# EAGLE design cw304_notduino_02 (EAGLE 7.5.0)
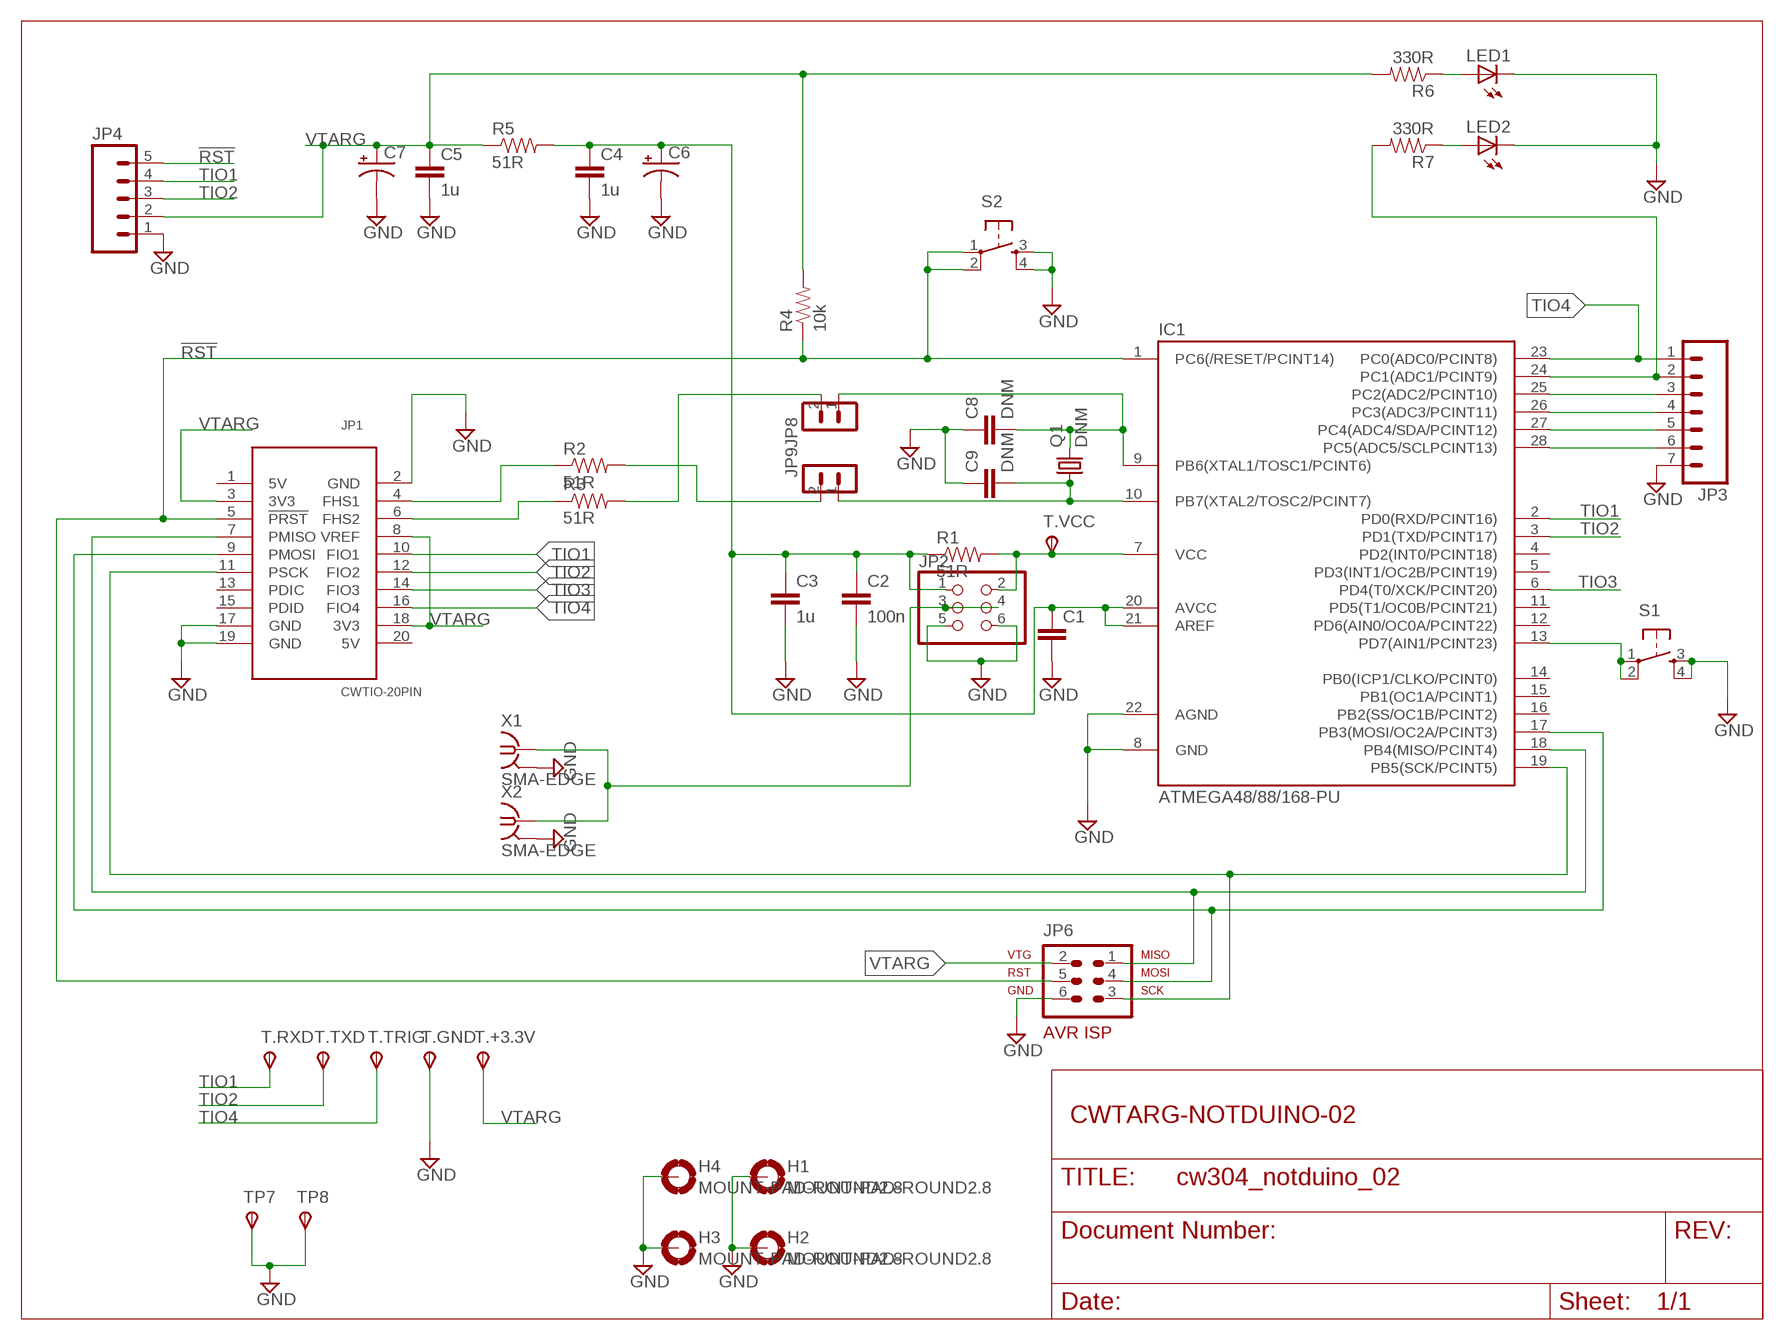
[diagram p0: schematic, sheet 1]

## Parts
C1  CAPPTH  [CAP-PTH-SMALL]
C2  100n  CAPPTH  [CAP-PTH-SMALL]
C3  1u  CAPPTH  [CAP-PTH-SMALL]
C4  1u  CAPPTH  [CAP-PTH-SMALL]
C5  1u  CAPPTH  [CAP-PTH-SMALL]
C6  CAP_POLPTH1  [CPOL-RADIAL-100UF-25V]
C7  CAP_POLPTH1  [CPOL-RADIAL-100UF-25V]
C8  DNM  CAPPTH  [CAP-PTH-SMALL]
C9  DNM  CAPPTH  [CAP-PTH-SMALL]
H1  MOUNT-PAD-ROUND2.8  [2,8-PAD]
H2  MOUNT-PAD-ROUND2.8  [2,8-PAD]
H3  MOUNT-PAD-ROUND2.8  [2,8-PAD]
H4  MOUNT-PAD-ROUND2.8  [2,8-PAD]
IC1  ATMEGA48/88/168-PU  [DIL28-3]
JP1  CWTIO-20PIN  [PINSHRD_PTH_2X10]
JP2  PINHD-2X3  [2X03]
JP3  M07LOCK  [1X07_LOCK]
JP4  M05LOCK  [1X05_LOCK]
JP6  AVR-ISP-6  [AVR-ISP-6]
JP8  M02LOCK  [1X02_LOCK]
JP9  M02LOCK  [1X02_LOCK]
LED1  LED5MM  [LED5MM]
LED2  LED5MM  [LED5MM]
Q1  DNM  CRYSTALHC49U-V  [HC49U-V]
R1  51R  RESISTORPTH-1/4W  [AXIAL-0.4]
R2  51R  RESISTORPTH-1/4W  [AXIAL-0.4]
R3  51R  RESISTORPTH-1/4W  [AXIAL-0.4]
R4  10k  RESISTORPTH-1/4W  [AXIAL-0.4]
R5  51R  RESISTORPTH-1/4W  [AXIAL-0.4]
R6  330R  RESISTORPTH-1/4W  [AXIAL-0.4]
R7  330R  RESISTORPTH-1/4W  [AXIAL-0.4]
S1  TAC_SWITCHPTH  [TACTILE-PTH]
S2  TAC_SWITCHPTH  [TACTILE-PTH]
T.+3.3V  TPSPAD1-13  [P1-13]
T.GND  TPSPAD1-13  [P1-13]
T.RXD  TPSPAD1-13  [P1-13]
T.TRIG  TPSPAD1-13  [P1-13]
T.TXD  TPSPAD1-13  [P1-13]
T.VCC  TPSPAD1-17  [P1-17]
TP7  TPSPAD1-17  [P1-17]
TP8  TPSPAD1-17  [P1-17]
X1  SMA-EDGE  [J502-ND-142-0711-821/826]
X2  SMA-EDGE  [J502-ND-142-0711-821/826]

## Nets
!RST: IC1.1(PC6(/RESET/PCINT14)) JP1.5(!PRST) JP4.5 JP6.5 R4.P$1 S2.1 S2.2
GND: C1.2 C2.2 C3.2 C4.2 C5.2 C6.2(-) C7.2(-) C8.1 C9.1 H1.B2,8(MOUNT) H2.B2,8(MOUNT) H3.B2,8(MOUNT) H4.B2,8(MOUNT) IC1.8(GND) IC1.22(AGND) JP1.2(GND) JP1.17(GND) JP1.19(GND) JP2.5 JP2.6 JP3.7 JP4.1 JP6.6 LED1.K(C) LED2.K(C) S1.3 S1.4 S2.3 S2.4 T.GND.TP(PP) TP7.TP(PP) TP8.TP(PP) X1.G@1 X1.G@2 X1.G@3 X1.G@4 X2.G@1 X2.G@2 X2.G@3 X2.G@4
N$2: LED2.A R7.P$1
N$4: IC1.18(PB4(MISO/PCINT4)) JP1.7(PMISO) JP6.1
N$5: IC1.17(PB3(MOSI/OC2A/PCINT3)) JP1.9(PMOSI) JP6.4
N$6: JP1.4(FHS1) R2.P$1
N$7: JP1.6(FHS2) R3.P$1
N$8: IC1.19(PB5(SCK/PCINT5)) JP1.11(PSCK) JP6.3
N$9: IC1.7(VCC) JP2.2 R1.P$2 T.VCC.TP(PP)
N$10: LED1.A R6.P$1
N$11: C1.1 C2.1 C3.1 C4.1 C6.1(+) IC1.20(AVCC) IC1.21(AREF) JP2.1 R1.P$1 R5.P$2
N$12: C8.2 IC1.9(PB6(XTAL1/TOSC1/PCINT6)) JP8.1 Q1.2
N$16: IC1.13(PD7(AIN1/PCINT23)) S1.1 S1.2
N$18: IC1.24(PC1(ADC1/PCINT9)) JP3.2 R7.P$2
N$19: IC1.25(PC2(ADC2/PCINT10)) JP3.3
N$20: IC1.26(PC3(ADC3/PCINT11)) JP3.4
N$21: IC1.27(PC4(ADC4/SDA/PCINT12)) JP3.5
N$22: IC1.28(PC5(ADC5/SCLPCINT13)) JP3.6
N$23: JP2.3 JP2.4 X1.1 X2.1
N$24: C9.2 IC1.10(PB7(XTAL2/TOSC2/PCINT7)) JP9.1 Q1.1
THS1: JP9.2 R2.P$2
THS2: JP8.2 R3.P$2
TIO1: IC1.2(PD0(RXD/PCINT16)) JP1.10(FIO1) JP4.4 T.RXD.TP(PP)
TIO2: IC1.3(PD1(TXD/PCINT17)) JP1.12(FIO2) JP4.3 T.TXD.TP(PP)
TIO3: IC1.6(PD4(T0/XCK/PCINT20)) JP1.14(FIO3)
TIO4: IC1.23(PC0(ADC0/PCINT8)) JP1.16(FIO4) JP3.1 T.TRIG.TP(PP)
VTARG: C5.1 C7.1(+) JP1.3(3V3) JP1.8(VREF) JP1.18(3V3) JP4.2 JP6.2 R4.P$2 R5.P$1 R6.P$2 T.+3.3V.TP(PP)
Unconnected: IC1.4(PD2(INT0/PCINT18)) IC1.5(PD3(INT1/OC2B/PCINT19)) IC1.11(PD5(T1/OC0B/PCINT21)) IC1.12(PD6(AIN0/OC0A/PCINT22)) IC1.14(PB0(ICP1/CLKO/PCINT0)) IC1.15(PB1(OC1A/PCINT1)) IC1.16(PB2(SS/OC1B/PCINT2)) JP1.1(5V) JP1.13(PDIC) JP1.15(PDID) JP1.20(5V)

## Notes on the sheet
- CWTARG-NOTDUINO-02

## Library data of the parts
C1-C5 C8 C9 = SparkFun:CAP: Capacitor Standard 0603 ceramic capacitor, and 0.1" leaded capacitor.
C6 C7 = SparkFun:CAP_POL: Capacitor Polarized These are standard SMD and PTH capacitors. Normally 10uF, 47uF, and 100uF in electrolytic and tantalum varieties. Always verify the external diameter of the through hole cap, it varies with capacity, voltage, and manufacturer. The EIA devices should be standard.
H1-H4 = holes:MOUNT-PAD-ROUND: MOUNTING PAD, round
IC1 = atmega8:ATMEGA48/88/168-PU
JP1 = chipwhisperer:CWTIO-20PIN
JP2 = pinhead:PINHD-2X3: PIN HEADER
JP3 = SparkFun:M07: Header 7 Standard 7-pin 0.1" header. Use with straight break away headers (SKU : PRT-00116), right angle break away headers (PRT-00553), swiss pins (PRT-00743), machine pins (PRT-00117), and female headers (PRT-00115). NOTES ON THE VARIANTS LOCK and LOCK_LONGPADS... This footprint was designed to help hold the alignment of a through-hole component (i.e. 7-pin header) while soldering it into place. You may notice that each hole has been shifted either up or down by 0.005 of an inch from it's more standard position (which is usually a perfectly straight line). This slight alteration caused the pins (the squares in the middle) to touch the edges of the holes. Because they are alternating, it causes a "brace" to hold the header in place. 0.005 has proven to be the perfect amount of "off-center" position when using our standard breakaway headers. Although looks a little odd when you look at the bare footprint, once you have a header in there, the alteration is very hard to notice. Also, if you push a header all the way into place, it is covered up entirely on the bottom side. This idea of altering the position of holes to aid alignment will be further integrated into the Sparkfun Library for other footprints. It can help hold any component with 3 or more connection pins.
JP4 = SparkFun:M05: Header 5 Standard 5-pin 0.1" header. Use with straight break away headers (SKU : PRT-00116), right angle break away headers (PRT-00553), swiss pins (PRT-00743), machine pins (PRT-00117), and female headers (PRT-00115). Molex polarized connector foot print use with SKU : PRT-08230 with associated crimp pins and housings.
JP6 = avr-6:AVR-ISP-6: AVR ISP-6 Serial Programming Header
JP8 JP9 = SparkFun:M02: Header 2 Standard 2-pin 0.1" header. Use with straight break away headers (SKU : PRT-00116), right angle break away headers (PRT-00553), swiss pins (PRT-00743), machine pins (PRT-00117), and female headers (PRT-00115). Molex polarized connector foot print use with SKU : PRT-08233 with associated crimp pins and housings.
LED1 LED2 = led:LED: LED OSRAM: - CHIPLED LG R971, LG N971, LY N971, LG Q971, LY Q971, LO R971, LY R971 LH N974, LH R974 LS Q976, LO Q976, LY Q976 LO Q996 - Hyper CHIPLED LW Q18S LB Q993, LB Q99A, LB R99A - SideLED LS A670, LO A670, LY A670, LG A670, LP A670 LB A673, LV A673, LT A673, LW A673 LH A674 LY A675 LS A676, LA A676, LO A676, LY A676, LW A676 LS A679, LY A679, LG A679 - Hyper Micro SIDELED® LS Y876, LA Y876, LO Y876, LY Y876 LT Y87S - SmartLED LW L88C, LW L88S LB L89C, LB L89S, LG L890 LS L89K, LO L89K, LY L89K LS L896, LA L896, LO L896, LY L896 - TOPLED LS T670, LO T670, LY T670, LG T670, LP T670 LSG T670, LSP T670, LSY T670, LOP T670, LYG T670 LG T671, LOG T671, LSG T671 LB T673, LV T673, LT T673, LW T673 LH T674 LS T676, LA T676, LO T676, LY T676, LB T676, LH T676, LSB T676, LW T676 LB T67C, LV T67C, LT T67C, LS T67K, LO T67K, LY T67K, LW E67C LS E67B, LA E67B, LO E67B, LY E67B, LB E67C, LV E67C, LT E67C LW T67C LS T679, LY T679, LG T679 LS T770, LO T770, LY T770, LG T770, LP T770 LB T773, LV T773, LT T773, LW T773 LH T774 LS E675, LA E675, LY E675, LS T675 LS T776, LA T776, LO T776, LY T776, LB T776 LHGB T686 LT T68C, LB T68C - Hyper Mini TOPLED® LB M676 - Mini TOPLED Santana® LG M470 LS M47K, LO M47K, LY M47K Source: http://www.osram.convergy.de LUXEON: - LUMILED® LXK2-PW12-R00, LXK2-PW12-S00, LXK2-PW14-U00, LXK2-PW14-V00 LXK2-PM12-R00, LXK2-PM12-S00, LXK2-PM14-U00 LXK2-PE12-Q00, LXK2-PE12-R00, LXK2-PE12-S00, LXK2-PE14-T00, LXK2-PE14-U00 LXK2-PB12-K00, LXK2-PB12-L00, LXK2-PB12-M00, LXK2-PB14-N00, LXK2-PB14-P00, LXK2-PB14-Q00 LXK2-PR12-L00, LXK2-PR12-M00, LXK2-PR14-Q00, LXK2-PR14-R00 LXK2-PD12-Q00, LXK2-PD12-R00, LXK2-PD12-S00 LXK2-PH12-R00, LXK2-PH12-S00 LXK2-PL12-P00, LXK2-PL12-Q00, LXK2-PL12-R00 Source: www.luxeon.com KINGBRIGHT: KA-3528ASYC Source: www.kingbright.com
Q1 = crystal:CRYSTAL: CRYSTAL; OC_FARNELL: 1666969; OC_NEWARK: unknown
R1-R7 = SparkFun:RESISTOR: Resistor Basic schematic elements and footprints for 0603, 1206, and PTH resistors.
S1 S2 = SparkFun:TAC_SWITCH: Momentary Switch Button commonly used for reset or general input. Spark Fun Electronics SKU : COM-00097
T.+3.3V T.GND T.RXD T.TRIG T.TXD T.VCC TP7 TP8 = testpad:TPS: TEST PIN
X1 X2 = custom-std:SMA-: SMA 50 Ohm End Launch Jack Receptacle - Round Contact Johnson Components Source: www.johnsoncomponents.com .. J502-ND.pdf; MF: JOHNSON COMPONENTS; MPN: 142-0711-821; OC_FARNELL: 1019328; OC_NEWARK: 16F3627

## Board
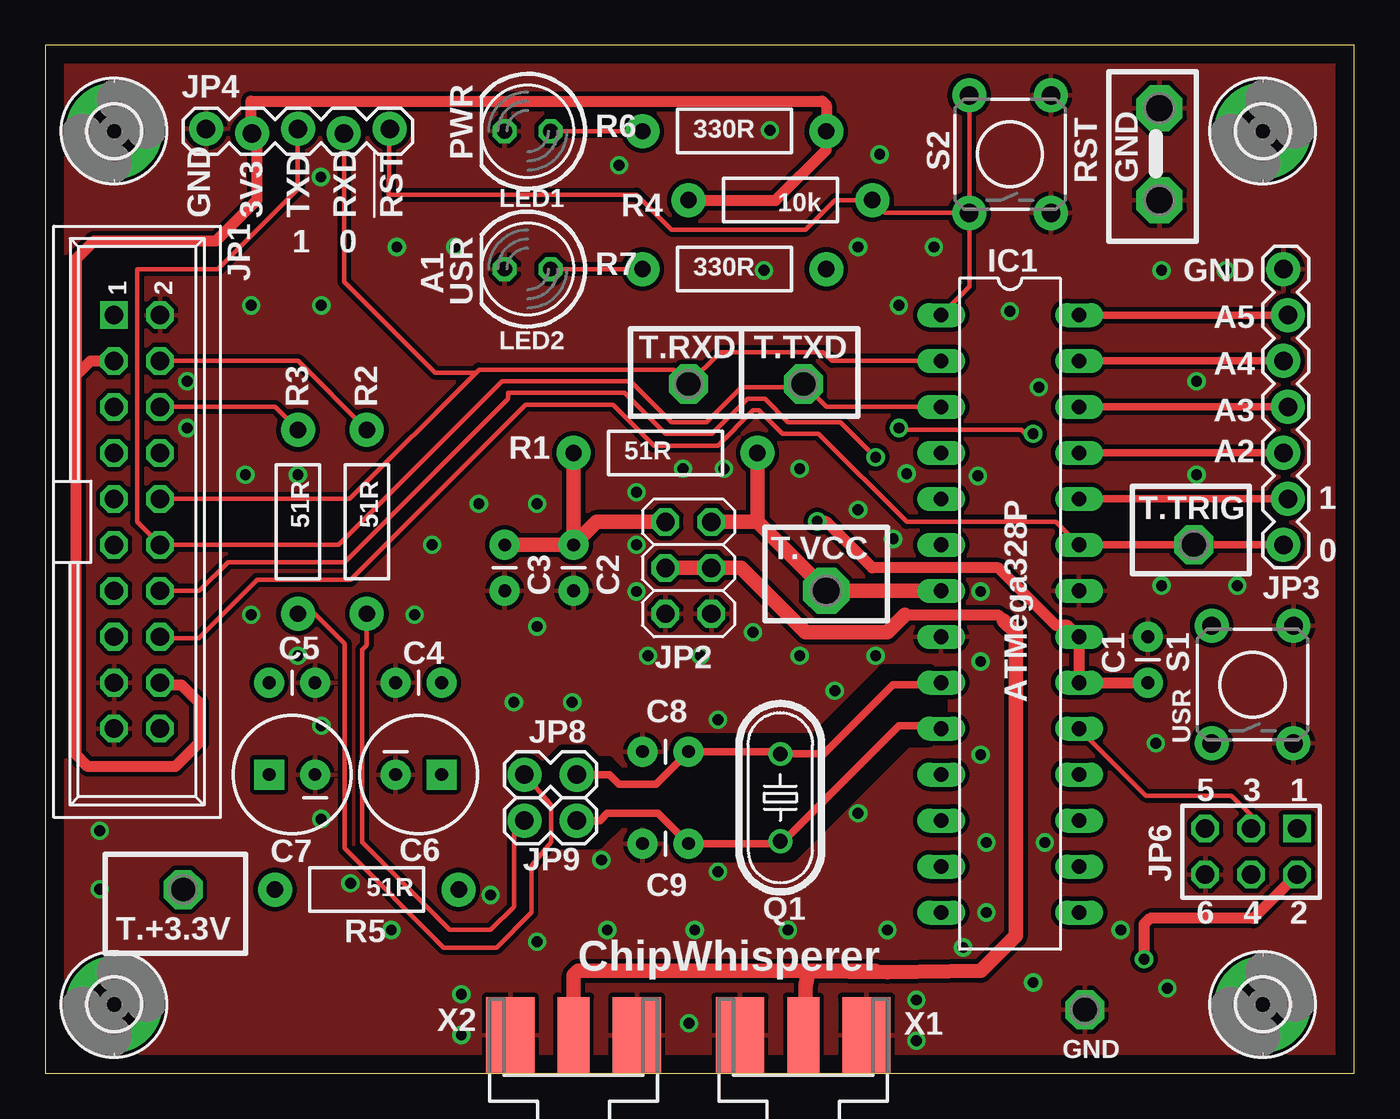
[diagram p1: board, top side]
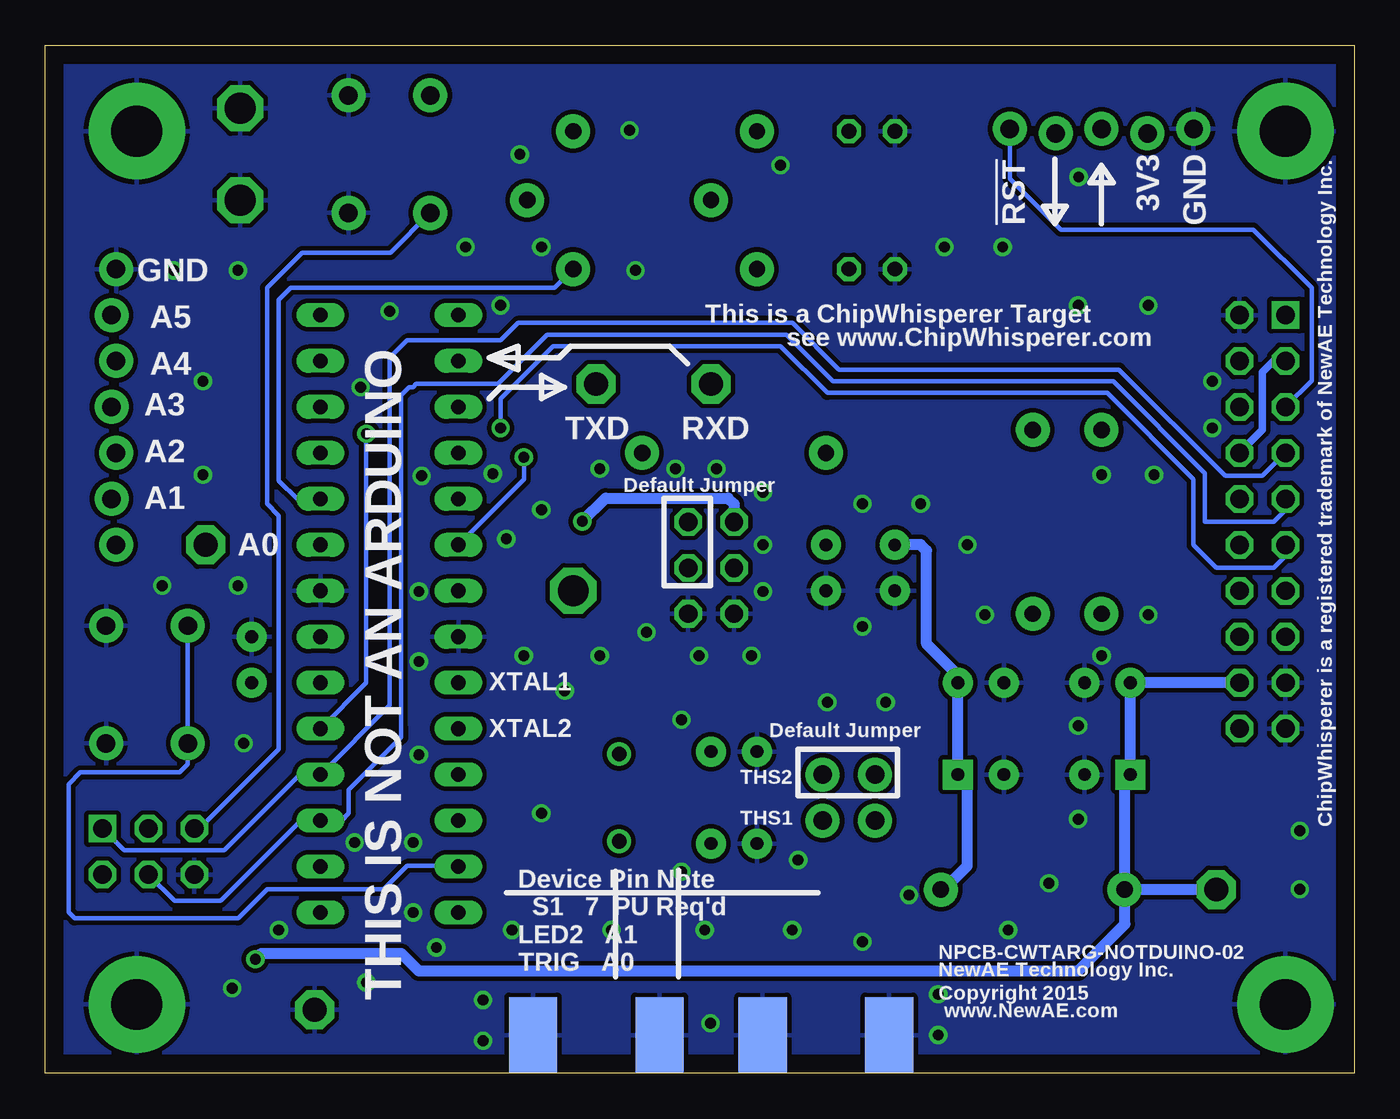
[diagram p2: board, bottom side, seen from below]

Size 72.37 x 56.82 mm. Coordinates in mm from the lower left corner, seen from the top.
Outline: 0,0 72.37,0 72.37,56.82 0,56.82 0,0
Copper layers (1*16): Top 0.035mm / dielectric 1.5mm / Bottom 0.035mm
Design rules "default *": minimum track width 10mil, minimum drill 24mil, track to track 8mil, track to pad 8mil, pad to pad 8mil, via to via 8mil, smd to smd 8mil, copper to edge 40mil, drill to drill 8mil, minimum pad ring 10mil, minimum via ring 8mil, stop-mask expansion 4mil, vias tented up to drill 40mil, thermal gap 10mil
tRestrict: 23 lines

### Footprints (pad centres in the part's own frame; a part is rotated, then mirrored left to right if it is on the bottom)
CAP-PTH-SMALL = drill 0.7 pad 1.651: 1 0,0; 2 2.54,0
CPOL-RADIAL-100UF-25V = drill 0.7 pad 1.651 square: 1 1.27,0 | drill 0.7 pad 1.651: 2 -1.27,0
2,8-PAD = drill 2.8 pad 5.334: B2,8 0,0
DIL28-3 = drill 0.813 long: 1 -16.51,-3.81; 2 -13.97,-3.81; 3 -11.43,-3.81; 4 -8.89,-3.81; 5 -6.35,-3.81; 6 -3.81,-3.81; 7 -1.27,-3.81; 8 1.27,-3.81; 9 3.81,-3.81; 10 6.35,-3.81; 11 8.89,-3.81; 12 11.43,-3.81; 13 13.97,-3.81; 14 16.51,-3.81; 15 16.51,3.81; 16 13.97,3.81; 17 11.43,3.81; 18 8.89,3.81; 19 6.35,3.81; 20 3.81,3.81; 21 1.27,3.81; 22 -1.27,3.81; 23 -3.81,3.81; 24 -6.35,3.81; 25 -8.89,3.81; 26 -11.43,3.81; 27 -13.97,3.81; 28 -16.51,3.81
PINSHRD_PTH_2X10 = drill 1.016 square: 1 -11.43,-1.27 | drill 1.016 octagon: 2 -11.43,1.27; 3 -8.89,-1.27; 4 -8.89,1.27; 5 -6.35,-1.27; 6 -6.35,1.27; 7 -3.81,-1.27; 8 -3.81,1.27; 9 -1.27,-1.27; 10 -1.27,1.27; 11 1.27,-1.27; 12 1.27,1.27; 13 3.81,-1.27; 14 3.81,1.27; 15 6.35,-1.27; 16 6.35,1.27; 17 8.89,-1.27; 18 8.89,1.27; 19 11.43,-1.27; 20 11.43,1.27
2X03 = drill 1.016 octagon: 1 -2.54,-1.27; 2 -2.54,1.27; 3 0,-1.27; 4 0,1.27; 5 2.54,-1.27; 6 2.54,1.27
1X07_LOCK = drill 1.016 pad 1.88: 1 0,0.127; 2 2.54,-0.127; 3 5.08,0.127; 4 7.62,-0.127; 5 10.16,0.127; 6 12.7,-0.127; 7 15.24,0.127
1X05_LOCK = drill 1.016 pad 1.88: 1 0,0.127; 2 2.54,-0.127; 3 5.08,0.127; 4 7.62,-0.127; 5 10.16,0.127
AVR-ISP-6 = drill 1.016 square: 1 -2.54,-1.27 | drill 1.016 octagon: 2 -2.54,1.27; 3 0,-1.27; 4 0,1.27; 5 2.54,-1.27; 6 2.54,1.27
1X02_LOCK = drill 1.016 pad 1.88: 1 -0.178,0; 2 2.718,0
LED5MM = drill 0.813 octagon: A -1.27,0; K 1.27,0
HC49U-V = drill 0.813: 1 -2.413,0; 2 2.413,0
AXIAL-0.4 = drill 0.9 pad 1.88: P$1 -5.08,0; P$2 5.08,0
TACTILE-PTH = drill 1.016 pad 1.88: 1 -3.251,2.261; 2 3.251,2.261; 3 -3.251,-2.261; 4 3.251,-2.261
P1-13 = drill 1.321 pad 2.159 octagon: TP 0,0
P1-17 = drill 1.702 pad 2.54 octagon: TP 0,0
J502-ND-142-0711-821/826 = smd 4.191 x 1.778: 1 2.115,0 | smd 4.191 x 2.667: G@1 2.115,3.495; G@2 2.115,-3.495 | smd 4.191 x 2.667 bottom: G@3 2.115,3.495; G@4 2.115,-3.495

### Placement (x,y rotation side)
C1  60.96,21.59 90 top
C2  29.21,29.21 270 top
C3  25.4,29.21 270 top
C4  21.91,21.59 180 top
C5  12.38,21.59 0 top
C6  20.64,16.51 0 top
C7  13.65,16.51 180 top
C8  33.02,17.78 0 top
C9  33.02,12.7 0 top
H1  3.81,3.81 0 top
H2  3.81,52.07 0 top
H3  67.31,52.07 0 top
H4  67.31,3.81 0 top
IC1  53.34,25.4 270 top
JP1  5.08,30.48 270 top
JP2  35.56,27.94 270 top
JP3  68.58,29.21 90 top
JP4  8.89,52.07 0 top
JP6  66.66,12.26 180 top
JP8  29.21,16.51 180 top
JP9  29.21,13.97 180 top
LED1  26.67,52.07 180 top
LED2  26.67,44.45 180 top
Q1  40.64,15.24 90 top
R1  34.29,34.29 0 top
R2  17.78,30.48 270 top
R3  13.97,30.48 270 top
R4  40.64,48.26 180 top
R5  17.78,10.16 0 top
R6  38.1,52.07 0 top
R7  38.1,44.45 0 top
S1  66.75,21.49 90 top
S2  53.34,50.8 90 top
T.+3.3V  7.62,10.16 0 top
T.GND  57.47,3.51 0 top
T.RXD  35.56,38.1 0 top
T.TRIG  63.5,29.21 0 top
T.TXD  41.91,38.1 0 top
T.VCC  43.18,26.67 0 top
TP7  61.59,53.34 0 top
TP8  61.59,48.26 0 top
X1  41.91,0 90 top
X2  29.21,0 90 top

### Tracks (layer width: path | path; a pad name or v marks a point on that pad's centre or on a via)
!RST
  Top 0.254: IC1.1 51.08,43.46 S2.1 | S2.1 S2.2 | R4.P$1 46.43,47.55 S2.1 | JP4.5 18.99,48.57 32.68,48.57 34.62,46.63 42.04,46.63 43.66,48.26 R4.P$1 | 45.72,48.76 R4.P$1
  Bottom 0.254: S2.1 53.28,45.34 58.17,45.34 60.1,43.41 60.1,31.47 59.46,30.83 59.46,17.93 63.85,13.53 JP6.5 | JP1.5 2.36,38.28 2.36,43.41 5.59,46.63 16.23,46.63 19.05,49.45 JP4.5
GND  (via drill 0.6)
  other vias: 45.91,23.09 41.71,23.09 43.65,21.15 37.2,19.54 37.2,11.15 44.94,14.38 30.75,11.8 27.2,7.28 24.62,9.86 19.13,7.92 16.88,10.51 15.26,14.05 15.26,19.22 13.97,23.09 11.39,25.34 20.42,25.34 13.97,33.09 11.07,33.09 7.84,35.67 7.84,38.25 27.2,31.47 23.97,31.47 27.2,24.7 21.39,29.22 32.68,29.22 32.68,26.63 32.68,32.12 35.26,33.41 37.52,33.41 41.71,33.41 44.94,31.15 46.88,29.54 51.71,26.63 51.71,22.76 51.71,17.6 52.04,12.76 52.04,8.89 55.26,12.76 54.62,5.02 48.17,1.8 46.55,7.92 41.07,7.92 35.91,7.92 31.07,7.92 35.59,2.76 48.17,4.05 23,2.12 3,10.18 3,13.41 15.24,49.54 11.39,42.44 15.26,42.44 19.44,45.67 22.66,45.67 44.94,45.67 49.13,45.67 39.74,44.38 46.13,50.79 40.06,52.12 31.71,50.18 33.33,23.09 36.23,23.09 39.13,24.38 29.13,20.51 25.91,20.51 61.71,26.96 65.91,26.96 61.71,44.38 65.26,44.38 53.33,42.12 47.2,42.44 54.94,37.92 51.56,33.02 47.62,33.15 63.65,33.09 63.65,38.25 50.75,6.96 23,4.38 61.39,18.25 59.46,7.92 62.04,4.7
  pour Top (isolate 0.254): 0.1,56.96 72.36,56.96 72.36,-0.14 0.1,-0.14
  pour Bottom (isolate 0.254): 0.1,56.96 72.36,56.96 72.36,-0.46 -0.22,-0.46 -0.22,56.96
N$2
  Top 0.254: R7.P$1 LED2.A
N$4
  Bottom 0.254: JP1.7 5.08,33.02 7.13,33.02 13.01,38.89 28.49,38.89 31.07,41.47 46.23,41.47 47.2,40.51 52.36,40.51 53.33,39.54 53.33,20.33 IC1.18 58.29,16.51 62.48,12.32 68,12.32 JP6.1
N$5
  Bottom 0.254: 3.81,32.28 JP1.9 3.81,31.12 4.45,30.48 8.26,30.48 8.26,33.17 13.33,38.25 28.81,38.25 31.39,40.83 44.62,40.83 47.35,38.1 51.86,38.1 52.04,37.92 52.24,37.92 52.7,37.47 52.7,19.11 52.68,19.08 52.68,18.57 55.59,15.67 55.59,14.38 55.99,13.97 IC1.17 58.25,13.97 62.68,9.54 65.21,9.54 JP6.4
N$6
  Top 0.254: JP1.4 13.97,39.37 R2.P$1
N$7
  Top 0.254: JP1.6 12.7,36.83 R3.P$1
N$8  (via drill 0.6)
  Top 0.254: v47.2,35.67 47.3,35.56 53.98,35.56 54.19,35.34 v54.62,35.34 | IC1.19 60.86,15.34 65.59,15.34 66.67,14.27 JP6.3
  Bottom 0.254: v47.2,35.67 47.2,37.28 44.3,40.18 31.71,40.18 29.13,37.6 13.65,37.6 8.89,32.84 8.89,29.21 7.62,27.94 4.45,27.94 3.81,28.58 JP1.11 | IC1.19 54.62,21.58 v54.62,35.34
N$9
  Top 0.813: IC1.7 T.VCC.TP | T.VCC.TP 42.97,26.67 42.68,26.96 42.89,26.96 T.VCC.TP | JP2.2 39.37,30.48 | 39.37,30.48 T.VCC.TP | R1.P$2 39.37,30.48
N$10
  Top 0.254: R6.P$1 LED1.A
N$11  (via drill 0.6)
  Top 0.61: C1.1 IC1.20 IC1.21 56.52,24.77 55.88,24.77 52.7,27.94 45.72,27.94 43.16,30.51 v42.68,30.51
  Top 0.813: R1.P$1 C2.1 | JP2.1 30.48,30.48 C2.1 | C3.1 C2.1
  Bottom 0.61: R5.P$2 22.7,10.16 21.39,11.47 21.39,15.99 C6.1 C4.1 21.59,21.67 23.65,23.73 23.65,28.89 23.97,29.22 C3.1 | v42.68,30.51 41.39,31.8 34.62,31.8 34.29,31.47 JP2.1
N$12
  Top 0.406: IC1.9 49.41,21.47 46.88,21.47 43.06,17.65 Q1.2 40.51,17.78 C8.2 33.77,15.99 31.71,15.99 31.19,16.51 JP8.1
N$16
  Bottom 0.254: IC1.13 49.57,11.47 52.36,11.47 53.65,10.18 60.1,10.18 61.71,8.57 70.75,8.57 71.07,8.89 71.07,15.99 70.42,16.63 64.94,16.63 64.49,17.09 S1.1 S1.2
N$18
  Top 0.406: IC1.24 JP3.2
  Bottom 0.254: R7.P$2 44.22,43.41 58.81,43.41 59.46,42.76 59.46,32.76 58.44,31.75 IC1.24
N$19
  Top 0.406: IC1.25 JP3.3
N$20
  Top 0.406: IC1.26 JP3.4
N$21
  Top 0.406: IC1.27 JP3.5
N$22
  Top 0.406: IC1.28 JP3.6
N$23
  Top 0.61: 47.52,25.34 52.68,25.34 53,25.02
  Top 0.813: JP2.3 JP2.4 38.47,27.94 42.04,24.38 46.55,24.38 47.52,25.34 | 53,25.02 | 53,25.02 53.65,24.38 53.65,7.6 51.71,5.67 46.55,5.6 42.2,5.63 | 42.2,5.63 42.04,4.83 42.04,1.93 | 42.04,1.8 42.04,1.93 | 42.04,1.93 X1.1 | X2.1 29.21,5.42 29.46,5.67 45.91,5.67 42.2,5.63
N$24
  Top 0.406: IC1.10 49.37,19.21 47.2,19.21 40.81,12.83 Q1.1 40.51,12.7 C9.2 33.88,14.38 31.07,14.38 30.66,13.97 JP9.1
THS1
  Top 0.254: R2.P$2 17.78,23.67 17.52,23.41 17.52,12.76 22.36,7.93 24.62,7.93 25.91,9.21 25.91,13.39 JP9.2
THS2
  Top 0.254: R3.P$2 14.88,25.4 16.55,23.73 16.55,12.44 22.04,6.96 24.94,6.96 26.88,8.89 26.88,11.47 27.97,12.76 27.97,14.84 JP8.2
TIO1
  Top 0.254: IC1.2 43.49,39.37 43,39.86 37.32,39.86 T.RXD.TP 34.77,38.89 23.97,38.89 23.81,38.73 | JP1.10 16.83,31.75 23.81,38.73 | JP4.4 16.53,50.65 16.53,43.75 21.55,38.73 23.81,38.73
TIO2
  Top 0.254: IC1.3 43.18,36.83 T.TXD.TP 41.73,37.92 38.49,37.92 36.55,35.99 34.62,35.99 32.36,38.25 25.26,38.25 16.23,29.21 JP1.12 5.08,30.48 5.08,44.45 9.53,44.45 13.95,48.87 13.95,52.18 JP4.3
TIO3  (via drill 0.6)
  Top 0.254: 33.65,35.99 34.3,35.34 36.88,35.34 38.81,37.28 39.78,37.28 41.07,35.99 43.97,35.99 v45.91,34.05 | JP1.14 8.52,26.67 10.1,28.25 16.55,28.25 25.59,37.28 25.59,37.6 32.04,37.6 33.65,35.99 | 33.65,35.99
  Bottom 0.254: IC1.6 45.91,32.83 v45.91,34.05
TIO4
  Top 0.254: JP1.16 6.43,24.05 8.49,24.05 11.71,27.28 16.88,27.28 26.55,36.96 31.39,36.96 33.65,34.7 37.2,34.7 39.13,36.63 39.46,36.63 40.75,35.34 42.76,35.34 47.62,30.48 55.88,30.48 IC1.23
  Top 0.406: IC1.23 T.TRIG.TP | 63.65,29.21 JP3.1 68.58,29.08
  Top 0.813: T.TRIG.TP 63.65,29.21
VTARG  (via drill 0.6)
  Top 0.61: JP1.18 6.47,21.47 7.52,21.47 8.49,20.5 8.49,18.25 7.2,16.96 2.36,16.96 1.71,17.6 1.71,38.57 | 1.71,38.57 2.52,39.37 JP1.3 | 1.71,38.57 1.71,45.02 2.68,45.99 9.44,45.99 11.69,48.25 11.69,51.68 JP4.2 11.37,52 11.37,53.73 42.96,53.73 43.18,53.51 R6.P$2 43.18,51.04 40.38,48.25 35.57,48.25 R4.P$2 | JP6.2 66.79,8.57 61.07,8.57 60.75,8.25 v60.75,6.31
  Bottom 0.406: JP1.8 5.08,35.56 5.08,38.73 4.45,39.37 JP1.3
  Bottom 0.61: 12.68,10.14 12.68,8.25 15.26,5.67 51.71,5.67 52.68,6.63 60.42,6.63 v60.75,6.31 | 12.68,10.14 R5.P$1 T.+3.3V.TP | JP1.18 C5.1 C7.1 12.68,16.49 12.68,10.14

### Text on the board
tPlace: PWR | RST | GND | GND | 3V3 | TXD | RXD | !RST | 1 | 0 | GND | A1 | USR | A5 | A4 | A3 | A2 | 1 | 0 | ATMega328P | USR | 5 | 3 | 1 | 6 | 4 | 2 | ChipWhisperer | GND
bPlace: ChipWhisperer is a registered trademark of NewAE Technology Inc. | GND | 3V3 | !RST | GND | A5 | This is a ChipWhisperer Target | see www.ChipWhisperer.com | A4 | A3 | RXD | TXD | A2 | Default Jumper | A1 | A0 | XTAL1 | Default Jumper | XTAL2 | THS2 | THS1 | NPCB-CWTARG-NOTDUINO-02 | NewAE Technology Inc. | Device Pin Note / S1 7 PU Req'd / LED2 A1 / TRIG A0 | www.NewAE.com | Copyright 2015 | THIS IS NOT AN ARDUINO